# Altium schematic sheet Driver_Motor_Sheet.SchDoc: Driver_Motor
size A4; Date: 13/10/2025; Author: Gerson T.& Lotfi D.; Organization: Universidad Distrital Francisco José de Caldas; DocumentNumber: 3; Revision: 1.0; SheetNumber: 3; SheetTotal: 4; Time: 16:49
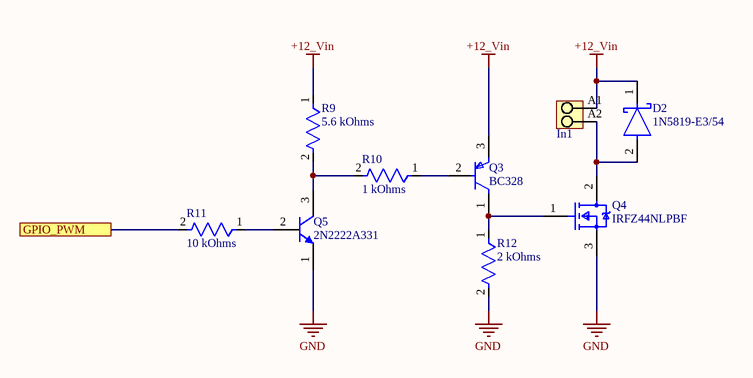
[diagram p0: Driver_Motor_Sheet.SchDoc]

## Parts
D2  1N5819-E3/54  [FP-1N5819-E3-54-MFG]
In1  1715310000  [LM_5_00_90_02]  (value not drawn)
Q3  BC328  [TO-92]
Q4  IRFZ44NLPBF  [FP-PG-TO262-3-MFG]
Q5  2N2222A331  [TO-92]
R9  5.6 kOhms  [FP-FMP100-MFG]
R10  1 kOhms  [FP-FMP100-MFG]
R11  10 kOhms  [FP-FMP100-MFG]
R12  2 kOhms  [FP-FMP100-MFG]

## Ports
GPIO_PWM (see ESP32WROOM_Sheet[5B])

## Nets
+12_Vin: D2.1(C) In1.A1 Q3.3(C) R9.1
GND: Q4.3(S) Q5.1(E) R12.2
GPIO_PWM: R11.2 ; port GPIO_PWM
NetD2_2: D2.2(A) In1.A2 Q4.2(D)
NetQ3_1: Q3.1(E) Q4.1(G) R12.1
NetQ3_2: Q3.2(B) R10.1
NetQ5_2: Q5.2(B) R11.1
NetQ5_3: Q5.3(C) R9.2 R10.2

## Library data of the parts
D2 = CMP-02539-000037-2: DIODE SCHOTTKY 40V 1A DO204AL; Capacitance: 110pF; Element Configuration: Single; Peak Non-Repetitive Surge Current: 25A; Forward Voltage: 900mV; Polarity: Standard; Peak Reverse Current: 1mA; Max Operating Temperature: 125°C; Forward Current: 1A; Package Quantity: 1; Average Rectified Current: 1A; Voltage: 40V; Radiation Hardening: No; Current: 1A; Max Reverse Voltage (DC): 40V; Height: 2.7mm; Output Current: 1A; Lead Free: Lead Free; Diameter: 2.7mm; Min Operating Temperature: -65°C; Max Repetitive Reverse Voltage (Vrrm): 40V; Number of Pins: 2; Width: 2.7mm; Length: 5.2mm; Current Rating: 1A; Packaging: Tape and Reel; Mount: Through Hole; Max Forward Surge Current (Ifsm): 25A; Voltage Rating (DC): 40V
In1 = CMP-1559-01745-1: OMNIMATE Signal - series LM; Manufacturer: Weidmueller; Contact_material: Cu-Leg; Contact_surface: tinned; Solder_pin_length_mm: 3,5 mm; Rated_voltage_for_surge_voltage_class_pollution_degree_II_2: 630 V; Short_text_for_material: LM 5.00/02/90 3.5SN OR BX; Pitch_inch: 0,197 inch; Pitch_mm: 5 mm; Wire_cross_section_AWG_min_UL_1059: AWG 24; No_of_poles: 2; Side_termination_characteristic: closed side; UL_94_flammability_rating: V-0; Mounting_onto_the_PCB: Solder connection; Rated_voltage_use_group_B_UL_1059: 300 V; Insulating_material: Wemid (PA); Solid_min_H05_07_V_U: 0,2 mm²; Rated_current_use_group_B_UL_1059: 15 A; Wire_cross_section_AWG_max_UL_1059: AWG 14; Solid_max_H05_07_V_U: 2,5 mm²; PartNumber: 1715310000; ComponentLink2Description: URL Link1; Revision: V1; ComponentLink1Description: Manufacturer URL; ComponentLink2URL: http://catalog.weidmueller.com/catalog/Start.do?localeId=en&ObjectID=1715310000; PackageReference: LM_5_00_90_02; Qty: 500 PCS; Colour: Orange; ComponentLink1URL: http://www.weidmueller.com/; Packaging: Box
Q3 = BC328: Collector Base Voltage: - 30 V; Collector Emitter Voltage: - 25 V; Emitter Base Voltage: - 5 V; Collector Current: - 800 mA; Peak Collector Current: - 1 A; Total Power Dissipation: 625 mW; Junction Temperature: 150 °C; DC Current Gain: 100 - 630; Collector Base Cutoff Current: - 100 nA; Collector Emitter Saturation Voltage: - 0.7 V; Base Emitter On Voltage: - 1.2 V; Gain Bandwidth Product: 100 MH; Collector Base Capacitance: 12 pF; Storage Temperature Range: - 55 to + 150 °C; Collector Base Breakdown Voltage: - 30 V; Collector Emitter Breakdown Voltage: - 25 V; Emitter Base Breakdown Voltage: - 5 V; ComponentLink1Description: Suplier; ComponentLink1URL: https://co.mouser.com/ProductDetail/onsemi-Fairchild/BC328?qs=UMEuL5FsraCayeUWgO8mfw%3D%3D&srsltid=AfmBOorf5xZwroEOplrd7QqiXYxDeoimh0FrK1nMyUL-RBvrlmJFWC5R; ComponentLink2Description: Datasheet (1); ComponentLink2URL: https://www.mouser.com/catalog/specsheets/fairchild%20semiconductor_bc327.pdf?_gl=1*1ayinll*_gcl_au*MTU3NTQyMTg3NS4xNzU3MzcyNzA1LjE4NDA3OTc0MTAuMTc2MDM4ODMxNC4xNzYwMzg4NDM1*_ga*MTE1MjgxNTUzOS4xNzU3MzcyNzA3*_ga_15W4STQT4T*czE3NjAzOTI0MjgkbzEyJGcxJHQxNzYwMzkzNzQyJGo2MCRsMCRoMA..; ComponentLink3Description: datasheet (2); ComponentLink3URL: https://www.alldatasheet.es/datasheet-pdf/view/281199/SEMTECH_ELEC/BC328.html
Q4 = CMP-00196-65874408-1: IRFZ44NLPBF Single N-Channel 55 V 17.5 mOhm 63 nC HEXFET® Power Mosfet - TO-262; Resistance: 17.5MΩ; Turn-On Delay Time: 12ns; Drain to Source Breakdown Voltage: 55V; Threshold Voltage: 4V; Rise Time: 60ns; Input Capacitance: 1.47nF; Power Dissipation: 110W; Max Junction Temperature (Tj): 175°C; Gate to Source Voltage (Vgs): 20V; Number of Channels: 1; Fall Time: 45ns; Max Power Dissipation: 3.8W; Continuous Drain Current (ID): 49A; Turn-Off Delay Time: 44ns; Case/Package: TO-262; Lifecycle Status: Production; Packaging: Bulk; RoHS: Compliant; Radiation Hardening: No; Height: 9.65mm; Voltage Rating (DC): 55V; On-State Resistance: 17.5mΩ; Width: 4.826mm; Mount: Through Hole; Max Operating Temperature: 175°C; Schedule B: 8541290080, 8541290080; Termination: Through Hole; Dual Supply Voltage: 55V; Package Quantity: 1000; Min Operating Temperature: -55°C; Lead Free: Contains Lead, Lead Free; Drain to Source Voltage (Vdss): 55V; Element Configuration: Single; Length: 10.668mm; Rds On Max: 17.5mΩ; Number of Pins: 3; Current Rating: 49A; REACH SVHC: No SVHC; Drain to Source Resistance: 17.5mΩ; NexarPartId: 65874408; Number of Elements: 1; Nominal Vgs: 4V
Q5 = 2N2222A331: Bipolar (Bjt) Single Transistor, Npn, 30 V, 500 Mw, 800 Ma, 100 Rohs Compliant: Yes |Multicomp Pro 2N2222; Body Material: Metal; Collector Emitter Breakdown Voltage: 30V; hFE Min: 30; Max Collector Current: 800mA; Max Power Dissipation: 500mW; Number of Elements: 1; Transition Frequency: 250MHz; Supplier: Newark; Supplier Part Number: 87K2254; Manufacturer: Multicomp; Manufacturer Part Number: 2N2222; RoHS: Compliant; Category: BJTs; Stock: 14638; Pricing: 1=0,685, 10=0,562, 50=0,429, 100=0,379, 500=0,361, 1000=0,311, 5000=0,286, 10000=0,274 (USD); Case/Package: TO-18; Collector Emitter Voltage (VCEO): 30V; Lifecycle Status: Production; Max Operating Temperature: 200°C; Pins: 3; Number of Terminals: 3; Polarity: NPN; Power Dissipation: 500mW; REACH SVHC: No; ComponentLink1URL: https://datasheet.octopart.com:443/2N2222-Multicomp-datasheet-632794.pdf?src-supplier=IHS; ComponentLink1Description: https://datasheet.octopart.com:443/2N2222-Multicomp-datasheet-632794.pdf?src-supplier=IHS; ComponentLink2URL: https://datasheet.octopart.com:443/2N2222-Multicomp-datasheet-12475390.pdf?src-supplier=Newark; ComponentLink2Description: https://datasheet.octopart.com:443/2N2222-Multicomp-datasheet-12475390.pdf?src-supplier=Newark
R9-R12 = CMP-00621-25629781-1: Resistor, 1 kOhm, ± 5%, 1 W, Axial Leaded, Metal Film, High Power Flame Proof; Power Rating: 1W; Resistance: 1kΩ; Temperature Coefficient: 100ppm/°C; Length: 6.3mm; Min Operating Temperature: -55°C; Tolerance: 5%; RoHS: Compliant; Military Standard: Not; Mount: Through Hole; Case/Package: Conformal; Diameter: 2.4mm; Schedule B: 8533210090, 8533210090; Radiation Hardening: No; Lead Free: Lead Free; Composition: Metal Film; Max Operating Temperature: 155°C; Termination: Axial